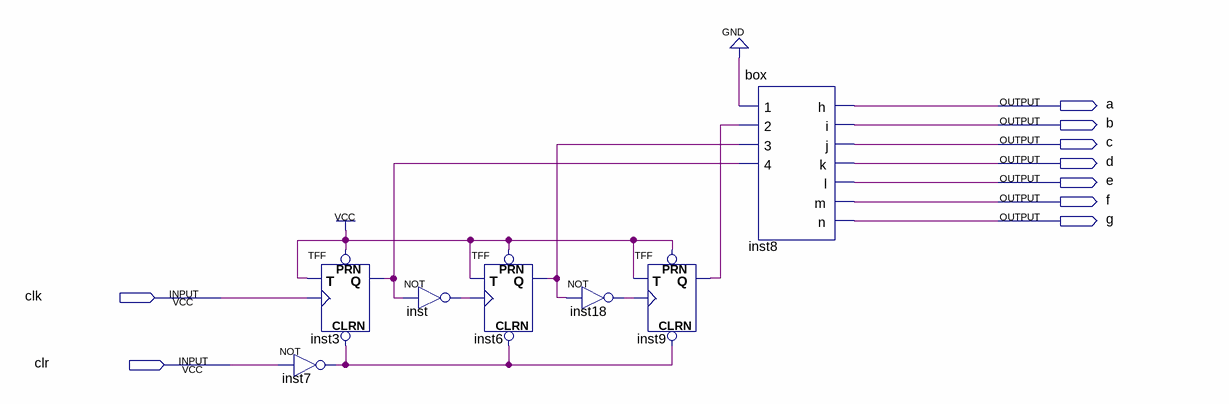
[diagram p0: schematic sheet]
// Quartus schematic bcd.bdf as structural Verilog: 7 symbols, 9 pins
module bcd (
  input  clk,
  input  clr,
  output a,
  output b,
  output c,
  output d,
  output e,
  output f,
  output g
);

  wire inst3_q, inst6_q, inst7_out, inst9_q, inst18_out, inst_out;

  TFF inst3 (.PRN(1'b1), .CLRN(inst7_out), .T(1'b1), .CLK(clk), .Q(inst3_q));
  not inst7 (inst7_out, clr);
  not inst (inst_out, inst3_q);
  TFF inst6 (.PRN(1'b1), .CLRN(inst7_out), .T(1'b1), .CLK(inst_out), .Q(inst6_q));
  TFF inst9 (.PRN(1'b1), .CLRN(inst7_out), .T(1'b1), .CLK(inst18_out), .Q(inst9_q));
  not inst18 (inst18_out, inst6_q);
  box inst8 (.\1 (1'b0), .\2 (inst9_q), .\3 (inst6_q), .\4 (inst3_q), .h(a), .i(b), .j(c), .k(d), .l(e), .m(f), .n(g));
endmodule
